# Altium schematic sheet 9_licenses.SchDoc: SPI memory (FM25V02A)
size A4; SheetNumber: 5; SheetTotal: 8
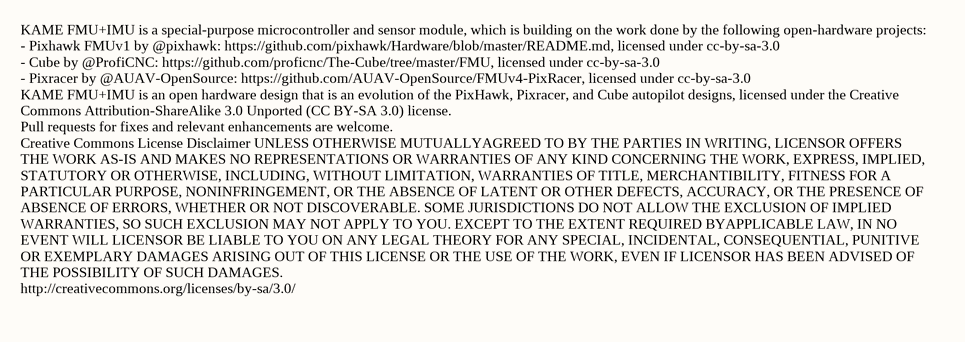
[diagram p0: 9_licenses.SchDoc]

## Notes on the sheet
- KAME FMU+IMU is a special-purpose microcontroller and sensor module, which is building on the work done by the following open-hardware projects:
  - Pixhawk FMUv1 by @pixhawk: https://github.com/pixhawk/Hardware/blob/master/README.md, licensed under cc-by-sa-3.0
  - Cube by @ProfiCNC: https://github.com/proficnc/The-Cube/tree/master/FMU, licensed under cc-by-sa-3.0
  - Pixracer by @AUAV-OpenSource: https://github.com/AUAV-OpenSource/FMUv4-PixRacer, licensed under cc-by-sa-3.0
  KAME FMU+IMU is an open hardware design that is an evolution of the PixHawk, Pixracer, and Cube autopilot designs, licensed under the Creative
  Commons Attribution-ShareAlike 3.0 Unported (CC BY-SA 3.0) license.
  Pull requests for fixes and relevant enhancements are welcome.
  Creative Commons License Disclaimer UNLESS OTHERWISE MUTUALLYAGREED TO BY THE PARTIES IN WRITING, LICENSOR OFFERS
  THE WORK AS-IS AND MAKES NO REPRESENTATIONS OR WARRANTIES OF ANY KIND CONCERNING THE WORK, EXPRESS, IMPLIED,
  STATUTORY OR OTHERWISE, INCLUDING, WITHOUT LIMITATION, WARRANTIES OF TITLE, MERCHANTIBILITY, FITNESS FOR A
  PARTICULAR PURPOSE, NONINFRINGEMENT, OR THE ABSENCE OF LATENT OR OTHER DEFECTS, ACCURACY, OR THE PRESENCE OF
  ABSENCE OF ERRORS, WHETHER OR NOT DISCOVERABLE. SOME JURISDICTIONS DO NOT ALLOW THE EXCLUSION OF IMPLIED
  WARRANTIES, SO SUCH EXCLUSION MAY NOT APPLY TO YOU. EXCEPT TO THE EXTENT REQUIRED BYAPPLICABLE LAW, IN NO
  EVENT WILL LICENSOR BE LIABLE TO YOU ON ANY LEGAL THEORY FOR ANY SPECIAL, INCIDENTAL, CONSEQUENTIAL, PUNITIVE
  OR EXEMPLARY DAMAGES ARISING OUT OF THIS LICENSE OR THE USE OF THE WORK, EVEN IF LICENSOR HAS BEEN ADVISED OF
  THE POSSIBILITY OF SUCH DAMAGES.
  http://creativecommons.org/licenses/by-sa/3.0/
- Title
- Size:
- Date:
- A4
- Number:
- Time:
- Revision:
- Sheet
- of
- File: